# EasyEDA Pro project ProPrj_PW4040赛题_2025-08-08-15-28-32.epro

# Schematic Schematic1
Board Name: Board1; Create Date: 2025-08-07; Page Name: P1; Project Name: PW4040赛题; Schematic Name: Schematic1; Update Date: 2025-08-07; Company: 嘉立创EDA; Page Size: A4; Version: V1.0
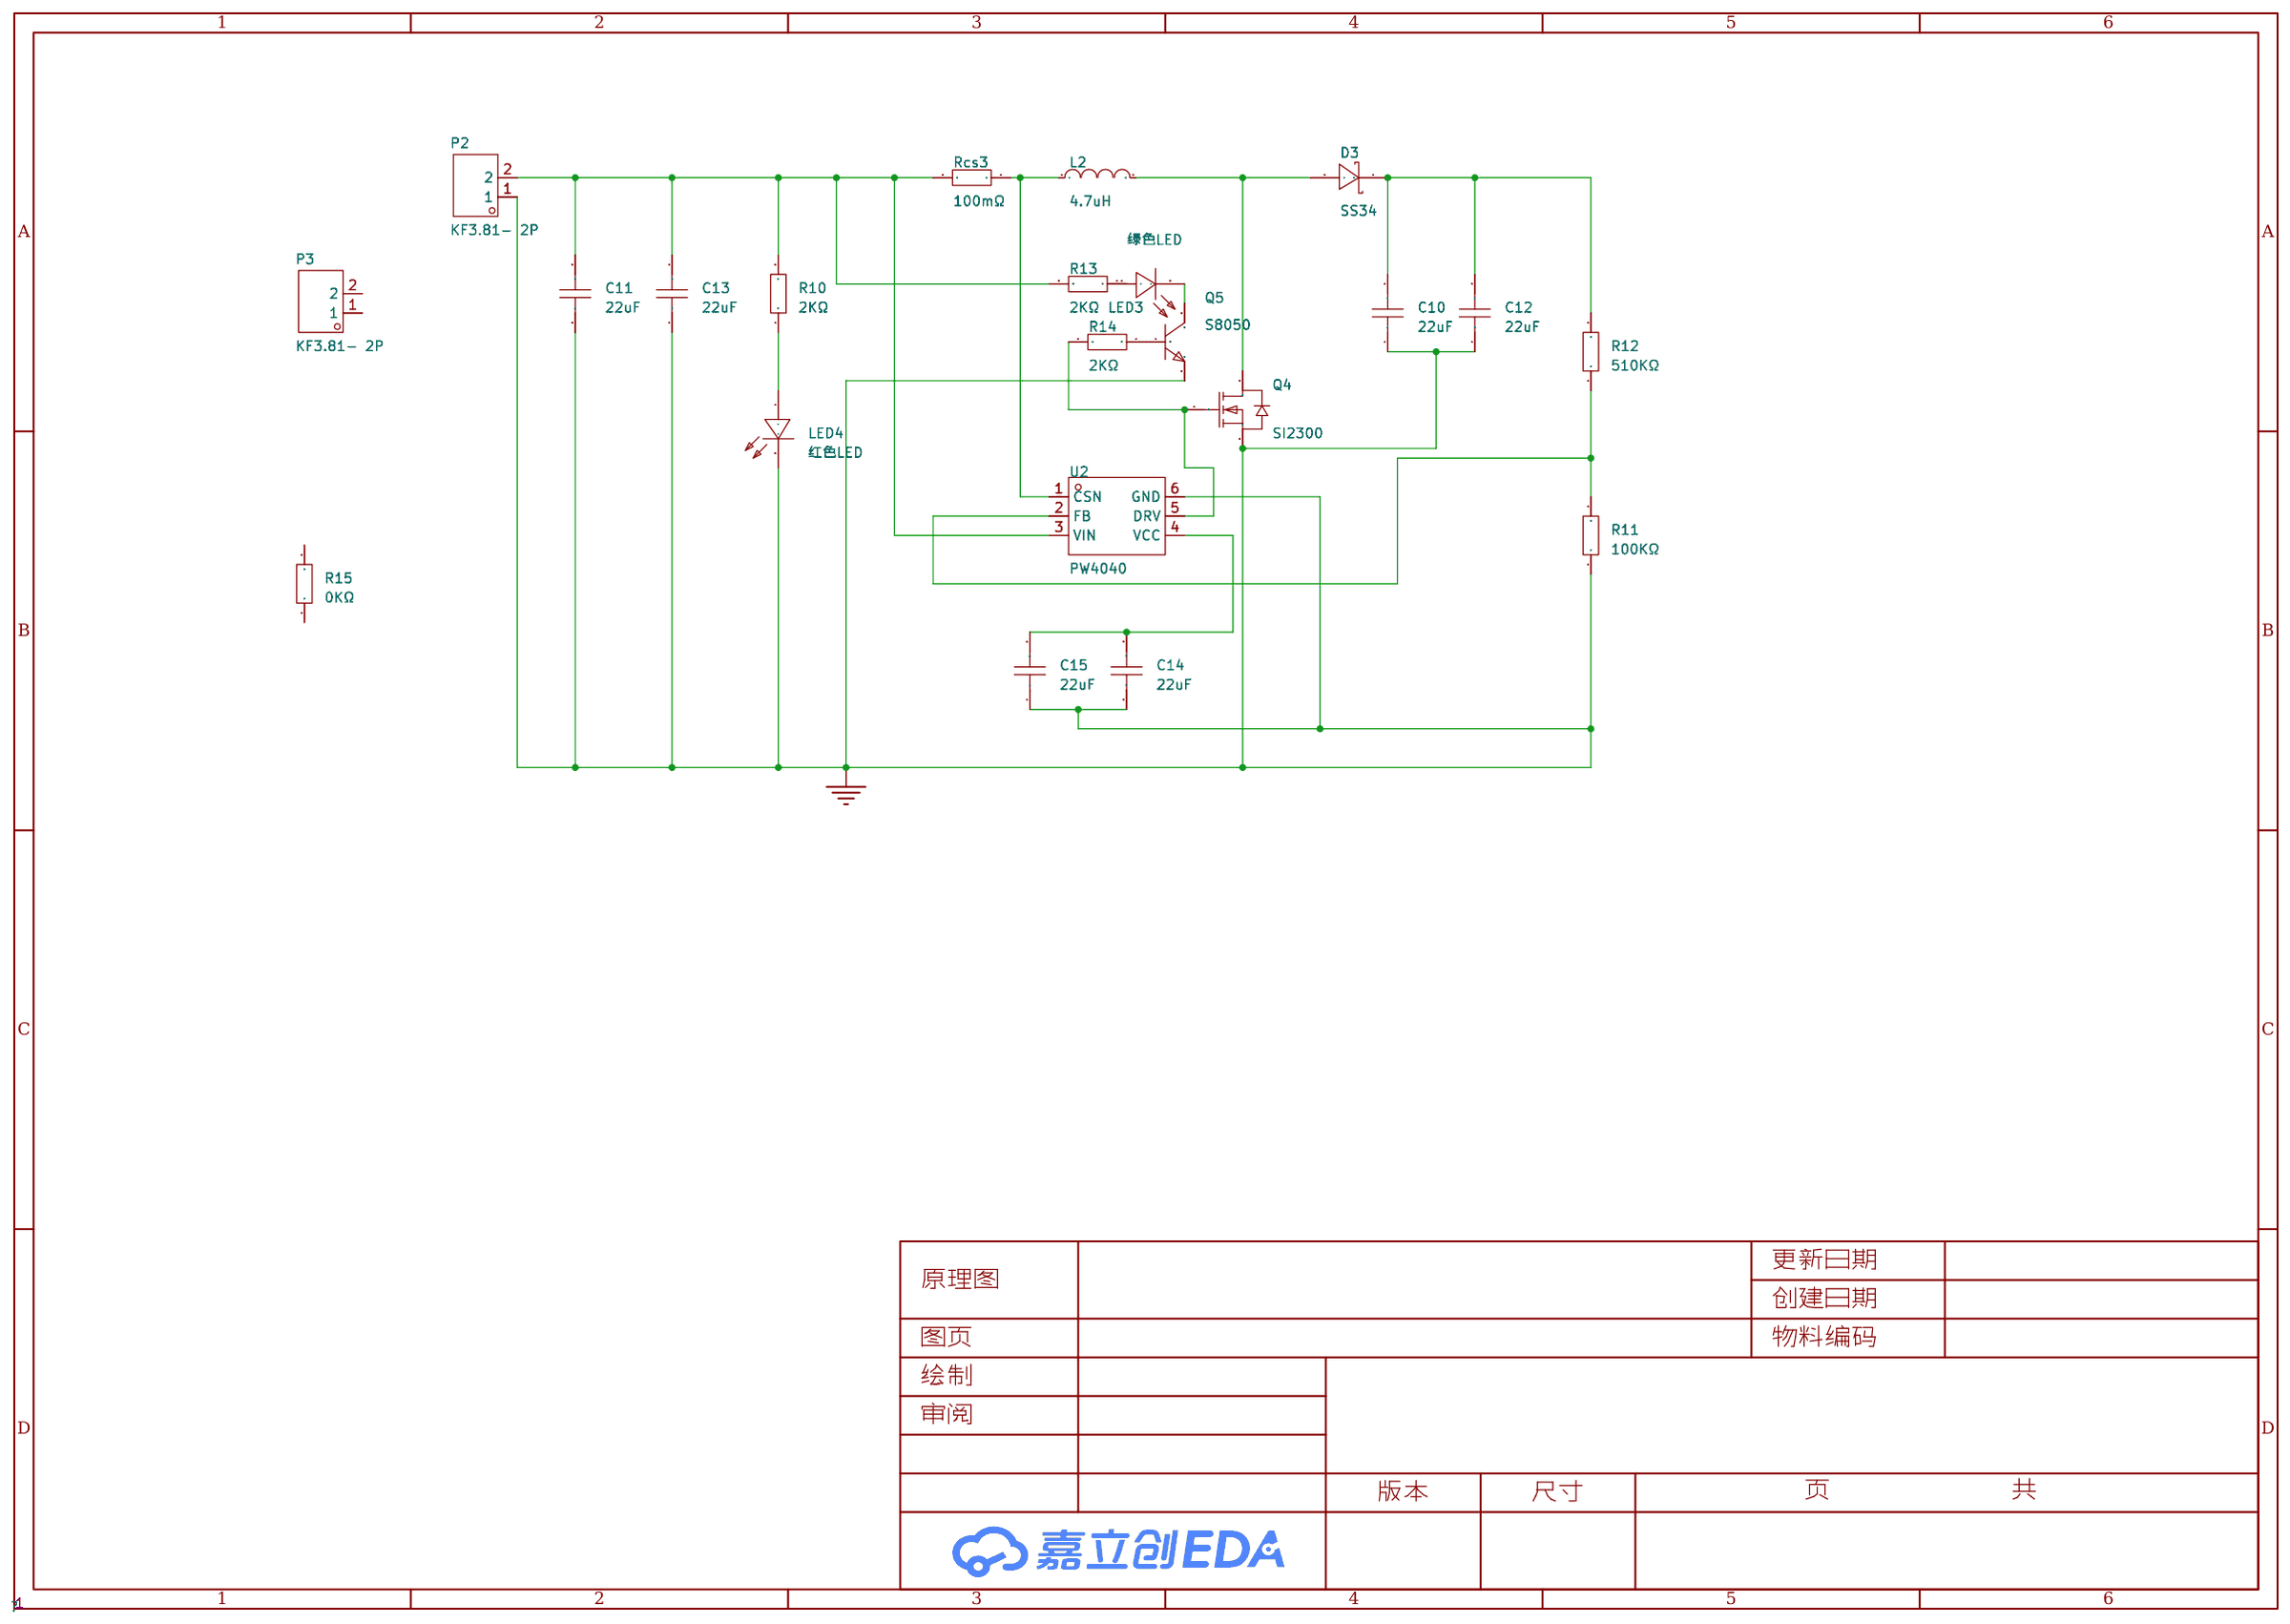
[diagram p0: schematic sheet]

## Parts
C10  22uF  [C0805]
C11  22uF  [C0805]
C12  22uF  [C0805]
C13  22uF  [C0805]
C14  22uF  [C0805]
C15  22uF  [C0805]
D3  SS34  [SMA(DO-214AC)]
L2  4.7uH  [IND-SMD_L5.4-W5.2]
LED3  绿色LED  [LED0805]
LED4  红色LED  [LED0805]
P2  KF3.81- 2P  [3.81 - 2P]
P3  KF3.81- 2P  [3.81 - 2P]
Q4  SI2300  [SOT-23(SOT-23-3)]
Q5  S8050  [SOT-23(SOT-23-3)]
R10  2KΩ  [R0805]
R11  100KΩ  [R0805]
R12  510KΩ  [R0805]
R13  2KΩ  [R0805]
R14  2KΩ  [R0805]
R15  0KΩ  [R0805]
Rcs3  100mΩ  [R2512]
U2  PW4040  [SOT-23(SOT-23-6)]

## Library data of the parts
C10-C15 = GRM21BR61H106KE43L: 容值:10uF;精度:±10%;额定电压:50V;材质(温度系数):X5R;; LCSC Part Name: 10uF ±10% 50V; Supplier Part: C440198; Manufacturer: muRata(村田); Supplier Footprint: 0805; JLCPCB Part Class: 基础库; Datasheet: https://atta.szlcsc.com/upload/public/pdf/source/20230811/95AAE0C9AF55EDC31B7A4D8B733F534E.pdf; Supplier: LCSC; Tolerance: ±10%; Voltage Rated: 50V; Temperature Coefficient: X5R
D3 = SS34_C8678: 二极管配置:独立式;正向压降(Vf):550mV@3A;直流反向耐压(Vr):40V;整流电流:3A;; LCSC Part Name: 电压:40V 电流:3A; Supplier Part: C8678; Manufacturer: MDD(辰达半导体); JLCPCB Part Class: 基础库; Datasheet: https://atta.szlcsc.com/upload/public/pdf/source/20240710/2118BB86FDDB2E0B294389AC1F3F65C8.pdf; Supplier: LCSC; Diode Configuration: 独立式; Forward Voltage (Vf@If): 550mV@3A; Reverse Voltage (Vr): 40V; Rectified Current: 3A; Reverse Leakage Current (Ir): 500uA@40V
L2 = FXL0530-100-M: 电感值:10uH;精度:±20%;额定电流:3.2A;饱和电流(Isat):3.5A;类型:一体成型电感;; LCSC Part Name: 10uH ±20% 3.5A; Supplier Part: C177248; Manufacturer: cjiang(长江微电); Supplier Footprint: SMD,5.2x5.4mm; JLCPCB Part Class: 扩展库; Datasheet: https://atta.szlcsc.com/upload/public/pdf/source/20240426/3189EA8206330E2108542F9E34E540E7.pdf; Supplier: LCSC; Tolerance: ±20%; Rated Current: 3.2A; Saturation Current (Isat): 3.5A; DC Resistance (DCR): 125mΩ; Type: 一体成型电感
LED3 LED4 = NCD0805R1: 灯头类型:-;发光颜色:红色;正向电压(VF):1.6V~2.6V;功率:65mW;正向电流:20mA;主波长:615nm~630nm;二极管配置:独立二极管;透镜颜色:无色透明透镜;色温:-;发光强度:67mcd~195mcd;发光角度:130°;载带方式:-;工作温度:-30℃~+85℃;; Supplier Part: C84256; Manufacturer: 国星光电; Supplier Footprint: 0805; JLCPCB Part Class: 基础库; Datasheet: https://atta.szlcsc.com/upload/public/pdf/source/20200820/C84256_F0A75A43B3EAD75808600A0514C76B99.pdf; Supplier: LCSC; Emitted Color: 红色; Forward Voltage (VF): 1.6V~2.6V; Power Dissipation: 65mW; Forward Current: 20mA; Dominant Wavelength: 615nm~630nm; Diode Configuration: 独立二极管; Lens Color: 无色透明透镜; Luminous Intensity: 67mcd~195mcd; Viewing Angle: 130°; Operating Temperature: -30℃~+85℃
P2 P3 = WJ15EDGRC-3.81-2P: 连接器类型:板端/插座-闭口;固定方式:-;结构:1x2P;间距:3.81mm;颜色:-;安装方式:弯针;排数:1;每排PIN数:2;额定电流:8A;额定电压:300V;线规 - AWG:-;线规 - 平方毫米:-;触头材质:黄铜;触头镀层:锡;工作温度范围:-40℃~+105℃;焊接温度(最大值):-;; LCSC Part Name: 1x2P 3.81mm 排数:1 每排P数:2; Supplier Part: C8387; Manufacturer: KANGNEX(康奈克斯电气); Supplier Footprint: 弯插,P=3.81mm; JLCPCB Part Class: 扩展库; Datasheet: https://atta.szlcsc.com/upload/public/pdf/source/20191225/C8387_8EBAF10345D2762F0167C8753398EEFA.pdf; Supplier: LCSC; Connector Type: 板端/插座-闭口; Structure: 1x2P; Pitch: 3.81mm; Mounting Style: 弯针; Number of Pins: 2P; Number of Rows: 1; Number of PINs Per Row: 2; Current Rating (Max): 8A; Voltage Rating (Max): 300V; Contact Material: 黄铜; Contact Plating: 锡; Operating Temperature Range: -40℃~+105℃
Q4 = SI2300DS-T1-GE3: 类型:1个N沟道;漏源电压(Vdss):30V;连续漏极电流(Id):3.6A;导通电阻(RDS(on)@Vgs,Id):68mΩ@4.5V,2.9A;功率(Pd):1.1W;阈值电压(Vgs(th)@Id):1.5V@250uA;; LCSC Part Name: 1个N沟道 耐压:30V 电流:3.6A; Supplier Part: C72271; Manufacturer: VISHAY(威世); Supplier Footprint: SOT-23; JLCPCB Part Class: 扩展库; Datasheet: https://atta.szlcsc.com/upload/public/pdf/source/20160507/1462613614814.pdf; Supplier: LCSC; Type: 1个N沟道; Drain Source Voltage (Vdss): 30V; Continuous Drain Current (Id): 3.6A; Drain Source On Resistance (RDS(on)@Vgs,Id): 68mΩ@4.5V,2.9A; Power Dissipation (Pd): 1.1W; Gate Threshold Voltage (Vgs(th)@Id): 1.5V@250uA; Total Gate Charge (Qg@Vgs): 6.5nC@10V; Input Capacitance (Ciss@Vds): 320pF@15V; Reverse Transfer Capacitance (Crss@Vds): 19pF@15V; Operating Temperature: -55℃~+150℃
Q5 = S8050: NPN 25V 500mA 120-400 SOT-23; Supplier Part: C2931719; Manufacturer: Doeshare(德芯); Supplier Footprint: SOT-23; JLCPCB Part Class: 扩展库; Datasheet: https://atta.szlcsc.com/upload/public/pdf/source/20220117/E6D3315E0D6ADDB25840BFFAC039C5C0.pdf; Supplier: LCSC
R10-R15 = 0805W8F2403T5E: 电阻类型:厚膜电阻;阻值:240kΩ;精度:±1%;功率:125mW;最大工作电压:150V;温度系数:±100ppm/℃;; LCSC Part Name: 240kΩ ±1% 125mW 厚膜电阻; Supplier Part: C25824; Manufacturer: UNI-ROYAL(厚声); Supplier Footprint: 0805; JLCPCB Part Class: 扩展库; Datasheet: https://atta.szlcsc.com/upload/public/pdf/source/20200306/C422600_1E6D84923E4A46A82E41ADD87F860B5C.pdf; Supplier: LCSC; Type: 厚膜电阻; Tolerance: ±1%; Power(Watts): 125mW; Overload Voltage (Max): 150V; Temperature Coefficient: ±100ppm/℃; Operating Temperature Range: -55℃~+155℃
Rcs3 = 25121WF100LT4E: 电阻类型:厚膜电阻;阻值:100mΩ;精度:±1%;功率:1W;最大工作电压:200V;温度系数:±800ppm/℃;; LCSC Part Name: 100mΩ ±1% 1W 厚膜电阻; Supplier Part: C25466; Manufacturer: UNI-ROYAL(厚声); Supplier Footprint: 2512; JLCPCB Part Class: 扩展库; Datasheet: https://atta.szlcsc.com/upload/public/pdf/source/20200306/C422600_1E6D84923E4A46A82E41ADD87F860B5C.pdf; Supplier: LCSC; Type: 厚膜电阻; Tolerance: ±1%; Power(Watts): 1W; Overload Voltage (Max): 200V; Temperature Coefficient: ±800ppm/℃; Operating Temperature Range: -55℃~+155℃
U2 = PW4040: Supplier Part: C9900029497; Supplier Footprint: SOT23-6L; Supplier: LCSC

## Nets
GND: C10.1 C11.1 C12.1 C13.1 C14.1 C15.1 LED4.2(-) P2.1 Q4.2(S) Q5.2(E) R11.1 U2.6(GND)
$1N6930: LED4.1(+) R10.1
$1N6932: L2.1 Rcs3.1 U2.1(CSN)
$1N6937: D3.2(A) L2.2 Q4.3(D)
$1N6941: C10.2 C12.2 D3.1(K) R12.2
$1N6974: LED3.1(+) R13.1
$1N6976: LED3.2(-) Q5.3(C)
$1N6978: Q5.1(B) R14.1
$1N6980: Q4.1(G) R14.2 U2.5(DRV)
$1N6987: R11.2 R12.1 U2.2(FB)
$1N7009: C14.2 C15.2 U2.4(VCC)
Net-(C11-2): C11.2 C13.2 P2.2 R10.2 R13.2 Rcs3.2 U2.3(VIN)

Not connected (* = marked no-connect by the designer): P3 1 2; R15 1 2

# Board PCB1
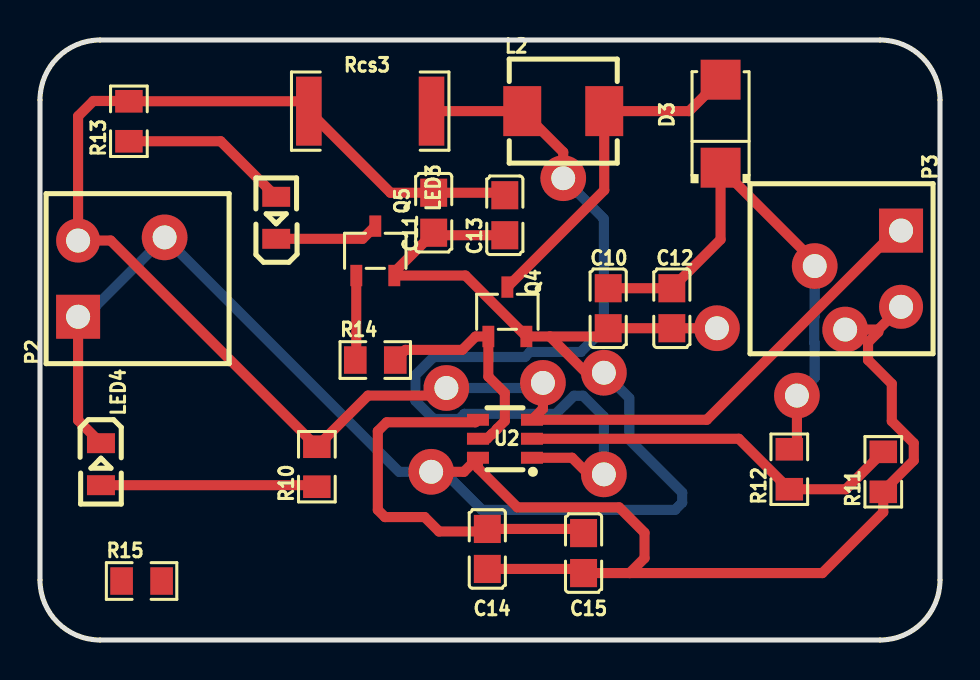
[diagram p1: board, top side]
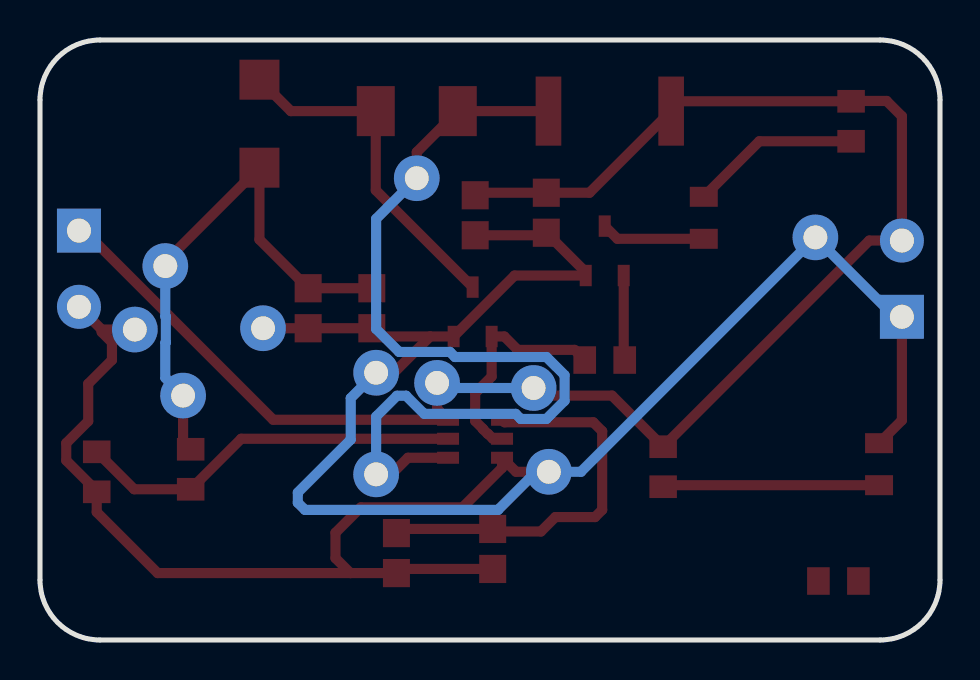
[diagram p2: board, bottom side, seen from below]

Outline 45 x 30 mm; copper layers: Top Layer, Bottom Layer. Coordinates in mm from the lower left corner of the outline.
Outline path: 0,27 0,3 arc(0.88,0.88) 3,0 42,0 arc(44.12,0.88) 45,3 45,27 arc(44.12,29.12) 42,30 3,30 arc(0.88,29.12) 0,27
Stack: Top Layer 0.035mm / Dielectric1 1.51mm FR4 er 4.5 / Bottom Layer 0.035mm

## Design rules (mm)
template: 自定义配置
spacing copperThickness1oz (default): track to track 0.254, other pairs 0.152 to 0.3
spacing copperThickness2oz: track to track 0.203, other pairs 0.152 to 0.3
track width copperThickness1oz (default): min 0.127, default 0.508, max 2.54
track width copperThickness2oz: min 0.203, default 0.254, max 2.54
differential pair differentialPair (default): width min 0.127, default 0.254, max 2.54; gap min 0.152, default 0.152
via viaSize (default): diameter min 0.5, default 0.61, max 10; hole min 0.3, default 0.305, max 6.299

## Placement (name value [footprint] x y rotation side)
C10  22uF  [C0805]  28.41 16.59 90 top
C11  22uF  [C0805]  19.69 21.36 90 top
C12  22uF  [C0805]  31.59 16.59 90 top
C13  22uF  [C0805]  23.24 21.24 90 top
C14  22uF  [C0805]  22.37 4.55 90 top
C15  22uF  [C0805]  27.18 4.35 90 top
D3  SS34  [SMA(DO-214AC)]  34.04 25.81 90 top
L2  4.7uH  [IND-SMD_L5.4-W5.2]  26.16 26.44 0 top
LED3  绿色LED  [LED0805]  11.81 21.11 90 top
LED4  红色LED  [LED0805]  3.05 8.79 270 top
NOREF  -  [Pad_e229]  20.32 12.6 0 top
NOREF#2  -  [Pad_e112]  19.56 8.41 0 top
NOREF#3  -  [Pad_e196]  33.85 15.59 0 top
NOREF#4  -  [Pad_e287]  28.19 8.28 0 top
NOREF#5  -  [Pad_e277]  25.15 12.86 0 top
NOREF#6  -  [Pad_e182]  38.74 18.7 0 top
NOREF#7  -  [Pad_e213]  37.85 12.22 0 top
NOREF#8  -  [Pad_e197]  40.26 15.52 0 top
NOREF#9  -  [Pad_e130]  28.19 13.36 0 top
NOREF#10  -  [Pad_e143]  6.23 20.13 0 top
NOREF#11  -  [Pad_e314]  26.16 23.09 0 top
P2  KF3.81- 2P  [3.81 - 2P]  1.91 18.06 90 top
P3  KF3.81- 2P  [3.81 - 2P]  43.05 18.57 270 top
Q4  SI2300  [SOT-23(SOT-23-3)]  23.37 16.41 270 top
Q5  S8050  [SOT-23(SOT-23-3)]  16.76 19.46 270 top
R10  2KΩ  [R0805]  13.84 8.66 90 top
R11  100KΩ  [R0805]  42.16 8.41 90 top
R12  510KΩ  [R0805]  37.47 8.54 90 top
R13  2KΩ  [R0805]  4.44 25.94 90 top
R14  2KΩ  [R0805]  16.76 14 0 top
R15  0KΩ  [R0805]  5.08 2.95 0 top
Rcs3  100mΩ  [R2512]  16.51 26.44 180 top
U2  PW4040  [SOT-23(SOT-23-6)]  23.24 10.06 0 top

## Footprints (pads in the part's own frame, mm; a bottom-side part is the same pattern mirrored in y, then rotated)
3.81 - 2P
  rect 2.2x2.2 hole 1.2: 1(-1.899,0)
  round 2.2 hole 1.2: 2(1.911,0)
C0805
  rect 1.41x1.35 smd: 1(-1,0) 2(1,0)
IND-SMD_L5.4-W5.2
  rect 1.9x2.5 smd: 1(-2.05,0) 2(2.05,0)
LED0805
  rect 1x1.399 smd: 1(1.05,0) 2(-1.05,0)
Pad_e112
  round 2.286 hole 1.194: 1(0,0)
Pad_e130
  round 2.286 hole 1.194: 1(0,0)
Pad_e143
  round 2.286 hole 1.194: 1(0,0)
Pad_e182
  round 2.286 hole 1.194: 2(0,0)
Pad_e196
  round 2.286 hole 1.194: 1(0,0)
Pad_e197
  round 2.286 hole 1.194: 2(0,0)
Pad_e213
  round 2.286 hole 1.194: 1(0,0)
Pad_e229
  round 2.286 hole 1.194: 1(0,0)
Pad_e277
  round 2.286 hole 1.194: 1(0,0)
Pad_e287
  round 2.286 hole 1.194: 1(0,0)
Pad_e314
  round 2.286 hole 1.194: 1(0,0)
R0805
  rect 1.133x1.377 smd: 1(-1,0) 2(1,0)
R2512
  rect 1.282x3.456 smd: 1(-3.067,0) 2(3.067,0)
SMA(DO-214AC)
  rect 2x2 smd: 1(-2.193,0.008) 2(2.207,0.008)
SOT-23(SOT-23-3)
  rect 1.07x0.6 smd: 1(1.235,-0.95) 2(1.235,0.95) 3(-1.235,0)
SOT-23(SOT-23-6)
  rect 1.1x0.6 smd: 1(1.357,-0.949) 2(1.357,0.001) 3(1.357,0.951) 4(-1.343,0.951) 5(-1.343,0.001) 6(-1.343,-0.949)

## Nets
GND: C10.1 C11.1 C12.1 C13.1 C14.1 C15.1 LED4.2 NOREF#2.1 NOREF#3.1 NOREF#8.2 NOREF#9.1 NOREF#10.1 P2.1 P3.2 Q4.2 Q5.2 R11.1 U2.6
$1N6930: LED4.1 R10.1
$1N6932: L2.1 NOREF#4.1 NOREF#11.1 Rcs3.1 U2.1
$1N6937: D3.2 L2.2 Q4.3
$1N6941: C10.2 C12.2 D3.1 NOREF#6.2 NOREF#7.1 R12.2
$1N6974: LED3.1 R13.1
$1N6976: LED3.2 Q5.3
$1N6978: Q5.1 R14.1
$1N6980: Q4.1 R14.2 U2.5
$1N6987: R11.2 R12.1 U2.2
$1N6995: C11.2 C13.2 NOREF.1 NOREF#5.1 P2.2 P3.1 R10.2 R13.2 Rcs3.2 U2.3
$1N7009: C14.2 C15.2 U2.4

Pads without a net: R15 1 2

## Routing (per net, layer and track width the routed paths; a pad name or vN(x,y) marks a point on that pad's centre or on a via; arc(x,y) is an arc through that point)
GND: length 130.7
  Top Layer w0.508: 29.48,3.35 C15.1 26.97,3.55 C14.1 ; 29.48,3.35 39.12,3.35 42.16,6.39 R11.1 42.29,7.54 42.29,7.58 43.69,8.98 43.69,9.84 42.59,10.94 42.59,12.81 41.4,14 41.4,14.88 41.92,15.39 41.92,15.52 ; 29.48,3.35 30.23,4.09 30.23,5.36 28.96,6.63 23.87,6.63 21.9,8.6 U2.6 21.2,8.41 NOREF#2.1 ; 25.49,15.18 28,15.18 C10.1 C12.1 NOREF#3.1 ; 25.49,15.18 Q4.2 21.27,18.22 Q5.2 17.71,18.39 C11.1 19.81,20.24 C13.1 ; 25.49,15.18 27.39,13.28 28.11,13.28 NOREF#9.1 ; P3.2 41.92,15.52 ; 41.92,15.52 NOREF#8.2 ; P2.1 1.91,10.98 LED4.2
  Bottom Layer w0.508: P2.1 2.26,16.16 NOREF#10.1 17.95,8.41 NOREF#2.1 20.19,8.41 22.1,6.5 31.75,6.5 32.11,6.86 32.11,7.37 29.46,10.02 29.46,12.09 NOREF#9.1
$1N6930: length 10.8
  Top Layer w0.508: R10.1 13.77,7.74 LED4.1
$1N6932: length 46.3
  Top Layer w0.508: NOREF#11.1 26.16,24.39 L2.1 Rcs3.1 ; NOREF#4.1 27.43,8.28 26.6,9.11 U2.1
  Bottom Layer w0.508: NOREF#4.1 28.19,11.17 27.15,12.21 26.69,12.21 25.79,11.31 21.22,11.31 20.96,11.05 19.68,11.05 18.77,11.96 18.77,13.24 19.68,14.15 24.25,14.15 24.5,14.4 27.04,14.4 28.19,15.55 28.19,21.06 NOREF#11.1
$1N6937: length 17.3
  Top Layer w0.508: D3.2 32.46,26.44 L2.2 28.21,22.49 Q4.3
$1N6941: length 26.8
  Top Layer w0.508: C10.2 C12.2 34.03,20.02 D3.1 38.74,18.91 NOREF#6.2 ; R12.2 37.85,9.92 NOREF#7.1
  Bottom Layer w0.508: NOREF#7.1 38.74,13.11 38.74,14.86 38.71,14.88 38.71,16.16 38.74,16.19 NOREF#6.2
$1N6974: length 8.5
  Top Layer w0.508: R13.1 9.03,24.94 LED3.1
$1N6976: length 5.2
  Top Layer w0.508: Q5.3 16.13,20.06 LED3.2
$1N6978: length 4.2
  Top Layer w0.508: R14.1 15.81,14.05 Q5.1
$1N6980: length 11.4
  Top Layer w0.508: U2.5 22.35,10.06 22.6,10.31 22.62,10.31 22.85,10.54 22.85,10.56 23.24,10.95 23.24,12.35 22.42,13.17 Q4.1 21.78,15.18 21.11,14.51 18.27,14.51 R14.2
$1N6987: length 19.4
  Top Layer w0.508: R11.2 40.29,7.54 R12.1 34.94,10.06 U2.2
$1N6995: length 82.7
  Top Layer w0.508: C13.2 23.11,22.36 C11.2 17.52,22.36 Rcs3.2 12.95,26.94 R13.2 4.43,26.95 2.67,26.95 1.91,26.19 P2.2 3.53,19.97 R10.2 16.4,12.22 19.81,12.22 20.19,12.6 ; 42.8,20.47 33.34,11.01 U2.3 25.15,11.56 NOREF#5.1
  Bottom Layer w0.508: NOREF.1 24.89,12.6 NOREF#5.1
$1N7009: length 20.1
  Top Layer w0.508: C15.2 26.97,5.55 C14.2 22.24,5.43 19.95,5.43 19.23,6.15 17.25,6.15 16.89,6.5 16.89,10.44 17.33,10.89 21.77,10.89 U2.4
